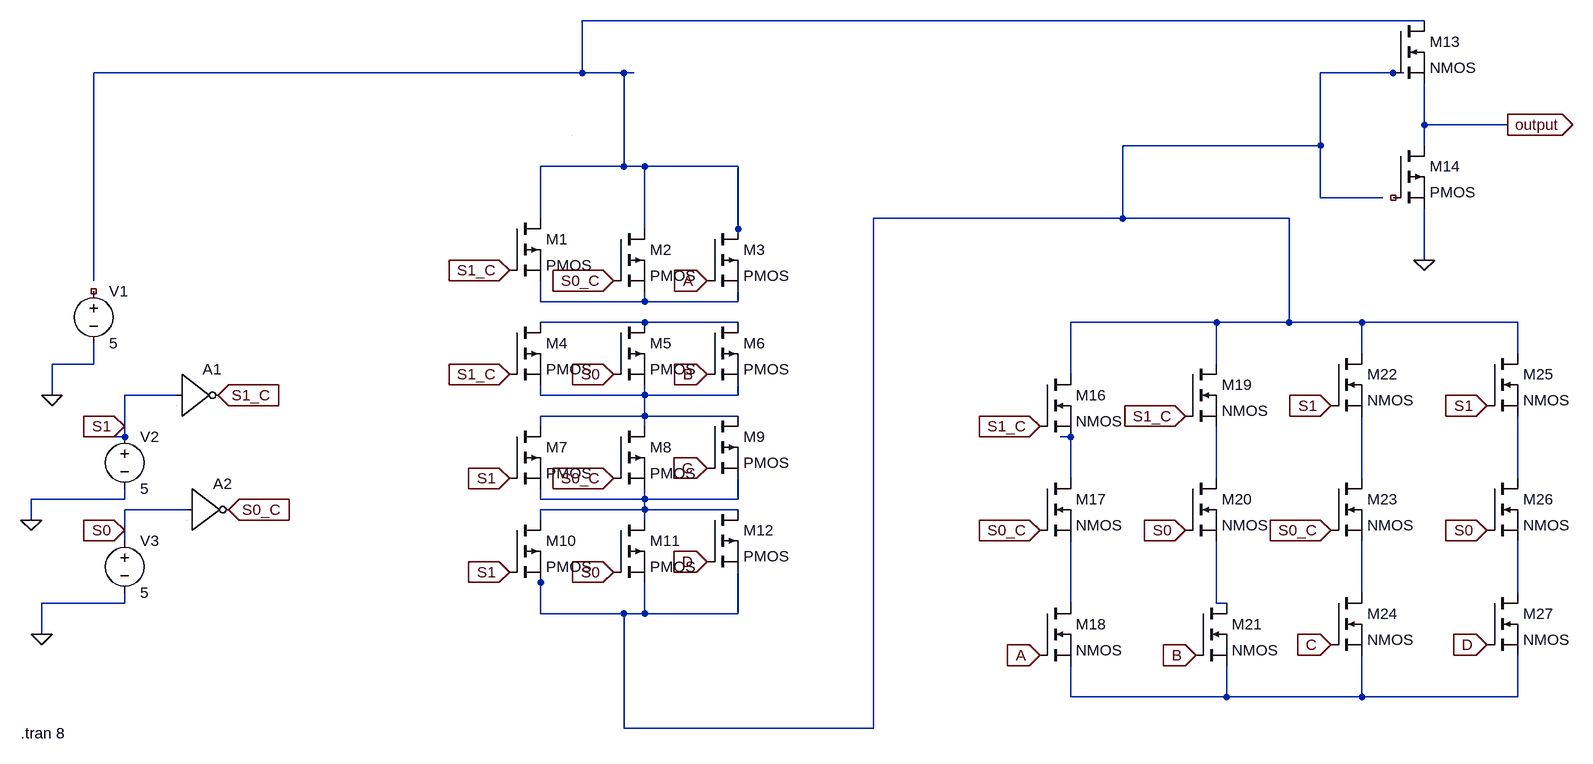
[diagram p0: schematic 4_1_mux_cmos.asc]
4_1_mux_cmos.asc, the LTspice schematic file:
Version 4.1
SHEET 1 1576 948
WIRE 1312 -176 16 -176
WIRE 16 -96 16 -176
WIRE 16 -96 -736 -96
WIRE 80 -96 16 -96
WIRE 96 -96 80 -96
WIRE 1264 -96 1152 -96
WIRE 1280 -96 1264 -96
WIRE 1312 -16 1312 -80
WIRE 1440 -16 1312 -16
WIRE 1152 16 1152 -96
WIRE 1152 16 848 16
WIRE 1312 16 1312 -16
WIRE 80 48 80 -96
WIRE 80 48 -48 48
WIRE 112 48 80 48
WIRE 256 48 112 48
WIRE 1152 96 1152 16
WIRE 1248 96 1152 96
WIRE -48 128 -48 48
WIRE 848 128 848 16
WIRE 848 128 464 128
WIRE 1104 128 848 128
WIRE 112 144 112 48
WIRE 256 144 256 48
WIRE 256 160 256 144
WIRE 1312 192 1312 112
WIRE -736 224 -736 -96
WIRE -48 256 -48 224
WIRE 112 256 112 240
WIRE 112 256 -48 256
WIRE 256 256 256 240
WIRE 256 256 112 256
WIRE 112 288 -48 288
WIRE 256 288 112 288
WIRE 992 288 768 288
WIRE 1104 288 1104 128
WIRE 1104 288 992 288
WIRE 1216 288 1104 288
WIRE 1456 288 1216 288
WIRE 1216 336 1216 288
WIRE 1456 336 1456 288
WIRE -736 352 -736 320
WIRE -736 352 -800 352
WIRE 992 352 992 288
WIRE 768 368 768 288
WIRE -800 400 -800 352
WIRE -608 400 -688 400
WIRE -48 400 -48 384
WIRE 112 400 112 384
WIRE 112 400 -48 400
WIRE 256 400 256 384
WIRE 256 400 112 400
WIRE 112 432 112 400
WIRE 112 432 -48 432
WIRE 256 432 112 432
WIRE -688 448 -688 400
WIRE -48 448 -48 432
WIRE 112 448 112 432
WIRE -688 464 -688 448
WIRE -688 464 -704 464
WIRE 768 464 752 464
WIRE 768 528 768 464
WIRE 992 528 992 448
WIRE 1216 528 1216 432
WIRE 1456 528 1456 432
WIRE -688 560 -688 544
WIRE -688 560 -832 560
WIRE -48 560 -48 544
WIRE 112 560 112 544
WIRE 112 560 -48 560
WIRE 256 560 256 528
WIRE 256 560 112 560
WIRE -592 576 -688 576
WIRE 112 576 112 560
WIRE 112 576 -48 576
WIRE 256 576 112 576
WIRE -832 592 -832 560
WIRE -48 592 -48 576
WIRE 112 592 112 576
WIRE -688 608 -688 576
WIRE -688 624 -688 608
WIRE -48 688 -48 672
WIRE 1216 704 1216 624
WIRE 1456 704 1456 624
WIRE -688 720 -688 704
WIRE -688 720 -816 720
WIRE 768 720 768 624
WIRE 992 720 992 624
WIRE 1008 720 992 720
WIRE -48 736 -48 688
WIRE 80 736 -48 736
WIRE 112 736 112 688
WIRE 112 736 80 736
WIRE 256 736 256 672
WIRE 256 736 112 736
WIRE -816 768 -816 720
WIRE 768 864 768 816
WIRE 1008 864 1008 816
WIRE 1008 864 768 864
WIRE 1216 864 1216 800
WIRE 1216 864 1008 864
WIRE 1456 864 1456 800
WIRE 1456 864 1216 864
WIRE 80 912 80 736
WIRE 464 912 464 128
WIRE 464 912 80 912
WIRE 0 0 0 0
FLAG -688 448 S1
IOPIN -688 448 In
FLAG -96 672 S1
IOPIN -96 672 In
FLAG -96 528 S1
IOPIN -96 528 In
FLAG -544 400 S1_C
IOPIN -544 400 In
FLAG 64 528 S0_C
IOPIN 64 528 In
FLAG -688 608 S0
IOPIN -688 608 In
FLAG -528 576 S0_C
IOPIN -528 576 In
FLAG -96 208 S1_C
IOPIN -96 208 In
FLAG -96 368 S1_C
IOPIN -96 368 In
FLAG 64 224 S0_C
IOPIN 64 224 In
FLAG 64 368 S0
IOPIN 64 368 In
FLAG 64 672 S0
IOPIN 64 672 In
FLAG 720 448 S1_C
IOPIN 720 448 In
FLAG 720 608 S0_C
IOPIN 720 608 In
FLAG 944 432 S1_C
IOPIN 944 432 In
FLAG 944 608 S0
IOPIN 944 608 In
FLAG 1168 416 S1
IOPIN 1168 416 In
FLAG 1408 416 S1
IOPIN 1408 416 In
FLAG 1168 608 S0_C
IOPIN 1168 608 In
FLAG 1408 608 S0
IOPIN 1408 608 In
FLAG 208 224 A
IOPIN 208 224 In
FLAG 720 800 A
IOPIN 720 800 In
FLAG 208 368 B
IOPIN 208 368 In
FLAG 960 800 B
IOPIN 960 800 In
FLAG 208 512 C
IOPIN 208 512 In
FLAG 1168 784 C
IOPIN 1168 784 In
FLAG 208 656 D
IOPIN 208 656 In
FLAG 1408 784 D
IOPIN 1408 784 In
FLAG -832 592 0
FLAG -816 768 0
FLAG -800 400 0
FLAG 1312 192 0
FLAG 1440 -16 output
IOPIN 1440 -16 Out
SYMBOL pmos -96 128 R0
SYMATTR InstName M1
SYMBOL pmos 64 144 R0
SYMATTR InstName M2
SYMBOL pmos 208 144 R0
SYMATTR InstName M3
SYMBOL pmos -96 288 R0
SYMATTR InstName M4
SYMBOL pmos 64 288 R0
SYMATTR InstName M5
SYMBOL pmos 208 288 R0
SYMATTR InstName M6
SYMBOL pmos -96 448 R0
SYMATTR InstName M7
SYMBOL pmos 64 448 R0
SYMATTR InstName M8
SYMBOL pmos 208 432 R0
SYMATTR InstName M9
SYMBOL pmos -96 592 R0
SYMATTR InstName M10
SYMBOL pmos 64 592 R0
SYMATTR InstName M11
SYMBOL pmos 208 576 R0
SYMATTR InstName M12
SYMBOL nmos 720 368 R0
SYMATTR InstName M16
SYMBOL nmos 720 528 R0
SYMATTR InstName M17
SYMBOL nmos 720 720 R0
SYMATTR InstName M18
SYMBOL nmos 944 352 R0
SYMATTR InstName M19
SYMBOL nmos 944 528 R0
SYMATTR InstName M20
SYMBOL nmos 960 720 R0
SYMATTR InstName M21
SYMBOL nmos 1168 336 R0
SYMATTR InstName M22
SYMBOL nmos 1168 528 R0
SYMATTR InstName M23
SYMBOL nmos 1168 704 R0
SYMATTR InstName M24
SYMBOL nmos 1408 336 R0
SYMATTR InstName M25
SYMBOL nmos 1408 528 R0
SYMATTR InstName M26
SYMBOL nmos 1408 704 R0
SYMATTR InstName M27
SYMBOL voltage -736 224 R0
SYMATTR InstName V1
SYMATTR Value 5
SYMBOL voltage -688 448 R0
SYMATTR InstName V2
SYMATTR Value 5
SYMBOL voltage -688 608 R0
SYMATTR InstName V3
SYMATTR Value 5
SYMBOL Digital\\inv -608 336 R0
SYMATTR InstName A1
SYMBOL Digital\\inv -592 512 R0
SYMATTR InstName A2
SYMBOL nmos 1264 -176 R0
SYMATTR InstName M13
SYMBOL pmos 1264 16 R0
SYMATTR InstName M14
TEXT -848 920 Left 2 !.tran 8

The netlist it stands for:
* 4_1_mux_cmos.asc
M1 N001 S1_C N003 N003 PMOS
M2 N001 S0_C N003 N003 PMOS
M3 N001 A N003 N003 PMOS
M4 N004 S1_C N005 N005 PMOS
M5 N004 S0 N005 N005 PMOS
M6 N004 B N005 N005 PMOS
M7 N005 S1 N010 N010 PMOS
M8 N005 S0_C N010 N010 PMOS
M9 N005 C N010 N010 PMOS
M10 N010 S1 N002 N002 PMOS
M11 N010 S0 N002 N002 PMOS
M12 N010 D N002 N002 PMOS
M16 N002 S1_C N006 N006 NMOS
M17 N006 S0_C N013 N013 NMOS
M18 N013 A N015 N015 NMOS
M19 N002 S1_C N007 N007 NMOS
M20 N007 S0 N014 N014 NMOS
M21 N014 B N015 N015 NMOS
M22 N002 S1 N008 N008 NMOS
M23 N008 S0_C N011 N011 NMOS
M24 N011 C N015 N015 NMOS
M25 N002 S1 N009 N009 NMOS
M26 N009 S0 N012 N012 NMOS
M27 N012 D N015 N015 NMOS
V1 NC_01 0 5
V2 S1 0 5
V3 S0 0 5
A1 S1 0 0 0 0 S1_C 0 0 BUF
A2 S0 0 0 0 0 S0_C 0 0 BUF
M13 N001 N002 output output NMOS
M14 output NC_02 0 0 PMOS
.model NMOS NMOS
.model PMOS PMOS
.lib standard.mos
.tran 8
.backanno
.end